# Altium schematic sheet MCP23017 - ENCODER.SchDoc
size B
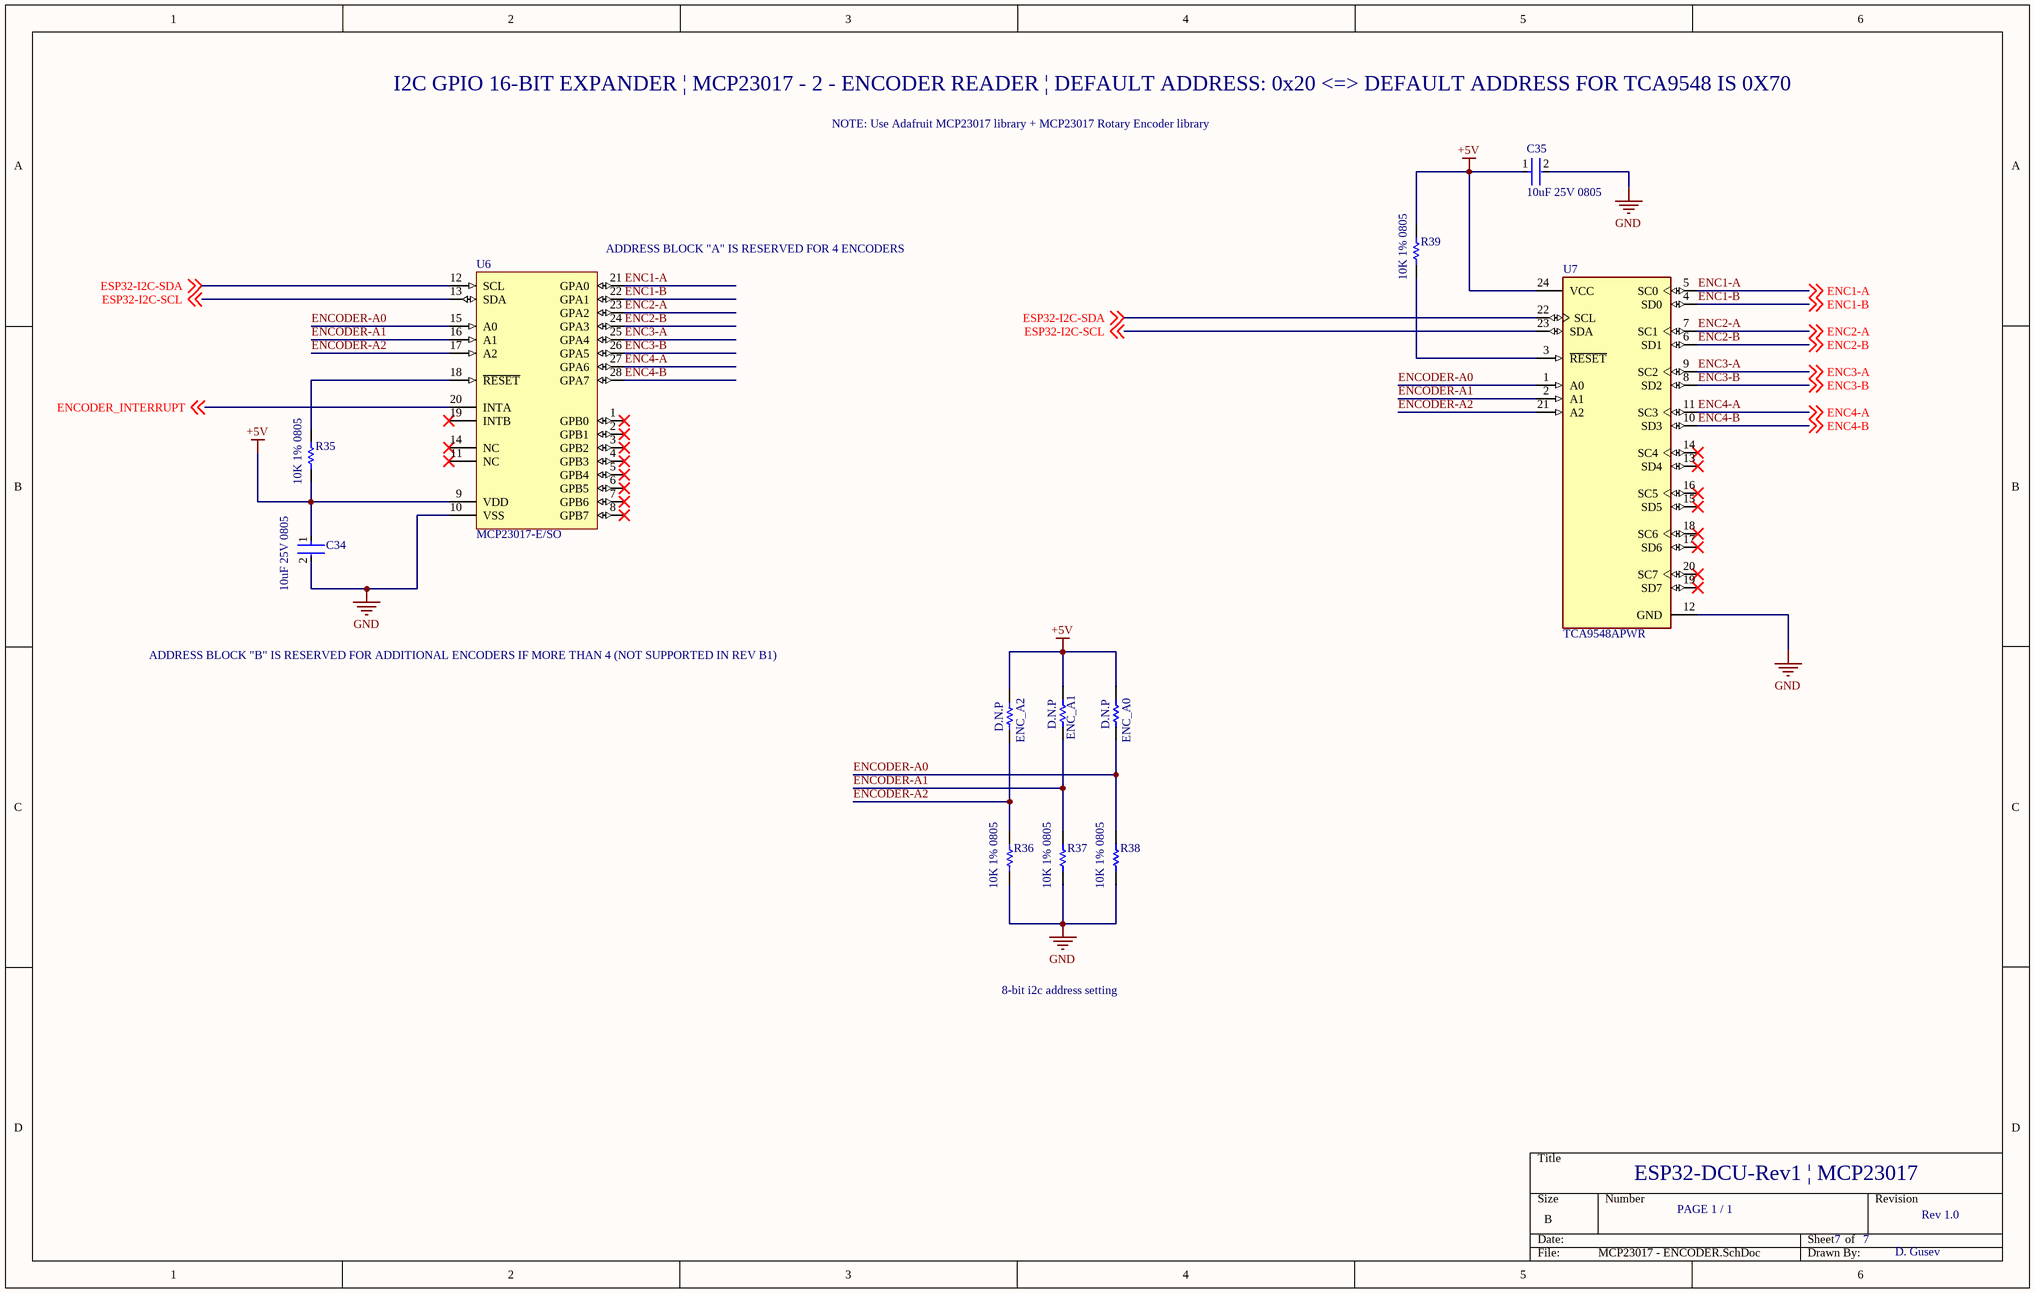
[diagram p0: MCP23017 - ENCODER.SchDoc]

## Parts
C34  10uF 25V 0805  [FP-GRM21B-0_15-IPC_B]
C35  10uF 25V 0805  [FP-GRM21B-0_15-IPC_B]
ENC_A0  D.N.P  [RESC2013X60X35LL10T20]
ENC_A1  D.N.P  [RESC2013X60X35LL10T20]
ENC_A2  D.N.P  [RESC2013X60X35LL10T20]
R35  10K 1% 0805  [RESC2013X60X35ML10T20]
R36  10K 1% 0805  [RESC2013X60X35ML10T20]
R37  10K 1% 0805  [RESC2013X60X35ML10T20]
R38  10K 1% 0805  [RESC2013X60X35ML10T20]
R39  10K 1% 0805  [RESC2013X60X35ML10T20]
U6  MCP23017-E/SO  [SOIC-SO28_N]
U7  TCA9548APWR  [FP-PW0024A-MFG]

## Nets
+5V: C34.1 C35.1 ENC_A0.2 ENC_A1.2 ENC_A2.2 R35.1 R39.2 U6.9(VDD) U7.24(VCC)
GND: C34.2 C35.2 R36.2 R37.2 R38.2 U6.10(VSS) U7.12(GND)
ENC1-A: U6.21(GPA0) U7.5(SC0) ; off-sheet ENC1-A
ENC1-B: U6.22(GPA1) U7.4(SD0) ; off-sheet ENC1-B
ENC2-A: U6.23(GPA2) U7.7(SC1) ; off-sheet ENC2-A
ENC2-B: U6.24(GPA3) U7.6(SD1) ; off-sheet ENC2-B
ENC3-A: U6.25(GPA4) U7.9(SC2) ; off-sheet ENC3-A
ENC3-B: U6.26(GPA5) U7.8(SD2) ; off-sheet ENC3-B
ENC4-A: U6.27(GPA6) U7.11(SC3) ; off-sheet ENC4-A
ENC4-B: U6.28(GPA7) U7.10(SD3) ; off-sheet ENC4-B
ENCODER-A0: ENC_A0.1 R38.1 U6.15(A0) U7.1(A0)
ENCODER-A1: ENC_A1.1 R37.1 U6.16(A1) U7.2(A1)
ENCODER-A2: ENC_A2.1 R36.1 U6.17(A2) U7.21(A2)
ENCODER_INTERRUPT: U6.20(INTA) ; off-sheet ENCODER_INTERRUPT
ESP32-I2C-SCL: U6.13(SDA) U7.23(SDA) ; off-sheet ESP32-I2C-SCL
ESP32-I2C-SDA: U6.12(SCL) U7.22(SCL) ; off-sheet ESP32-I2C-SDA
NetR35_2: R35.2 U6.18(~{RESET})
NetR39_1: R39.1 U7.3(~{RESET})

Not connected (* = marked no-connect by the designer): U6 1(GPB0)* 2(GPB1)* 3(GPB2)* 4(GPB3)* 5(GPB4)* 6(GPB5)* 7(GPB6)* 8(GPB7)* 11(NC)* 14(NC)* 19(INTB)*; U7 13(SD4)* 14(SC4)* 15(SD5)* 16(SC5)* 17(SD6)* 18(SC6)* 19(SD7)* 20(SC7)*

## Notes on the sheet
- I2C GPIO 16-BIT EXPANDER | MCP23017 - 2 - ENCODER READER | DEFAULT ADDRESS: 0x20 <=> DEFAULT ADDRESS FOR TCA9548 IS 0X70
- NOTE: Use Adafruit MCP23017 library + MCP23017 Rotary Encoder library
- (near U6) ADDRESS BLOCK "A" IS RESERVED FOR 4 ENCODERS
- ADDRESS BLOCK "B" IS RESERVED FOR ADDITIONAL ENCODERS IF MORE THAN 4 (NOT SUPPORTED IN REV B1)
- 8-bit i2c address setting
- ESP32-DCU-Rev1 | MCP23017
- PAGE 1 / 1
- 7
- Rev 1.0
- D. Gusev

## Library data of the parts
C34 C35 = CMP-2007-03541-2: Chip Multilayer Ceramic Capacitors for General Purpose, 0805, 10uF, X5R, 15%, 10%, 25V; Length: 2mm; Depth: 1.25mm; Termination: SMD/SMT; Voltage: 25V; Height: 1.25mm; Material: Ceramic; Thickness: 0.053inch; Radiation Hardening: No; Min Operating Temperature: -55°C; Width: 0.049inch; Package Quantity: 1; Mount: Surface Mount; Dielectric: X5R; Packaging: Tape and Reel; Capacitance: 10uF; Voltage Rating (DC): 25V; Lead Free: Lead Free; Max Operating Temperature: 85°C; Case Code (Imperial): 0805; Case/Package: 0805; Tolerance: 10%; Voltage Rating: 25V; Case Code (Metric): 2012
ENC_A0-ENC_A2 = CMP-1659-00014-4: Chip Resistor, 1 Ohm, +/- 1%, 125 mW, -55 to 155 degC, 0805 (2012 Metric), RoHS, Tape and Reel; Manufacturer: Yageo; Voltage Rating: 150 V; REACH SVHC: No SVHC; Mounting Technology: Surface Mount; RoHSCompliant: true; Packaging: Tape and Reel; ComponentLink2URL: http://www.yageo.com/documents/recent/PYu-RC_Group_51_RoHS_L_04.pdf; Pins: 2; Package Quantity: 5000; DatasheetVersion: Rev. 4, 02/2016; Mount: Surface Mount; Max Operating Temperature: 155 degC; PackageDescription: 2-Pin Surface Mounted Device, Body 2 x 1.25 mm; PackageReference: 0805; Length: 2 mm; Min Operating Temperature: -55 degC; ComponentLink1URL: http://www.yageo.com/; Height: 0.5 mm; ComponentLink1Description: Manufacturer URL; ComponentLink2Description: Datasheet
R35-R39 = CMP-2000-05025-1: Chip Resistor, 10 KOhm, +/- 5%, 0.125 W, -55 to 155 degC, 0805 (2012 Metric), RoHS, Tape and Reel; Manufacturer: Yageo; Resistor Element Type: ThickFilm; Voltage Rating: 150V; Product Range: RCSeries; SVHC: ToBeAdvised; Resistor Case Style: 0805[2012Metric]; Temperature Coefficient: ±100ppm/degC; Power Rating: 250mW; Resistance: 10kohm; Automotive Qualification Standard: -; Datasheet Version: REV. 2, 09/2004; Packaging: CutTape; Resistance Tolerance: ±5%; MSL: MSL1-Unlimited; Manufacturer URL: http://www.yageo.com/; Datasheet URL: http://www.yageo.ru/pdf/RC0805.pdf; Package Description: 2-Pin Surface Mounted Device, Body 2 x 1.25 mm; Package Reference: 805
U6 = CMP-0186-00161-2: 16-Bit I/O Expander with Serial Interface, 28-Pin SOIC, Extended Temperature; PackageReference: SOIC-SO28; ComponentLink2URL: http://ww1.microchip.com/downloads/en/DeviceDoc/21952b.pdf; PackageVersion: revBB, Aug-2009; ComponentLink1URL: http://www.microchip.com/; Code_JEDEC: MS-013; ComponentLink2Description: Datasheet; DatasheetVersion: revB, Feb-2007; PackageDescription: 28-Lead Plastic Small Outline (SO) - Wide 7.50mm Body [SOIC]; ComponentLink3Description: Package Specification; ComponentLink1Description: Manufacturer URL; RevisionNote: URLs added.; ComponentLink3URL: http://www.microchip.com/stellent/groups/techpub_sg/documents/packagingspec/en012702.pdf
U7 = CMP-04892-000002-1: IC I2C SW 8CH W/RESET 24TSSOP; Manufacturer: Texas Instruments; Number Of Circuits: 1; Mux Demux Ratio: 1:8; Nominal Supply Current: 2-50uA; Interface: I2C,SMBus; Min Supply Voltage: 1.65V; Standoff Height: 0.05mm; Max Supply Voltage: 5.5V; Device Class L2: Interface ICs; ComponentLink2Description: Datasheet; Ipc Land Pattern Name: SOP65P640X120-24; Category: IC; Device Class L1: Integrated Circuits (ICs); Manufacturer Part Number: TCA9548APWR; RoHS: TRUE; Temperature Range High: +85°C; Digikey Description: IC I2C SW 8CH W/RESET 24TSSOP; Temperature Range Low: -40°C; Lead Free: Yes; Package: PW0024A; ComponentLink2URL: http://www.ti.com/lit/ds/symlink/tca9548a.pdf; Device Class L3: Multiplexers; Ambient Temperature Range Low: -40°C; Mouser Description: Low-Voltage 8-Channel I2C Switch With Reset 24-TSSOP -40 to 85; Temperature: -40°C to +85°C; Octopart: https://octopart.com/tca9548apwr-texas+instruments-22266789; Ambient Temperature Range High: +85°C; Automotive: No; Height: 1.2mm